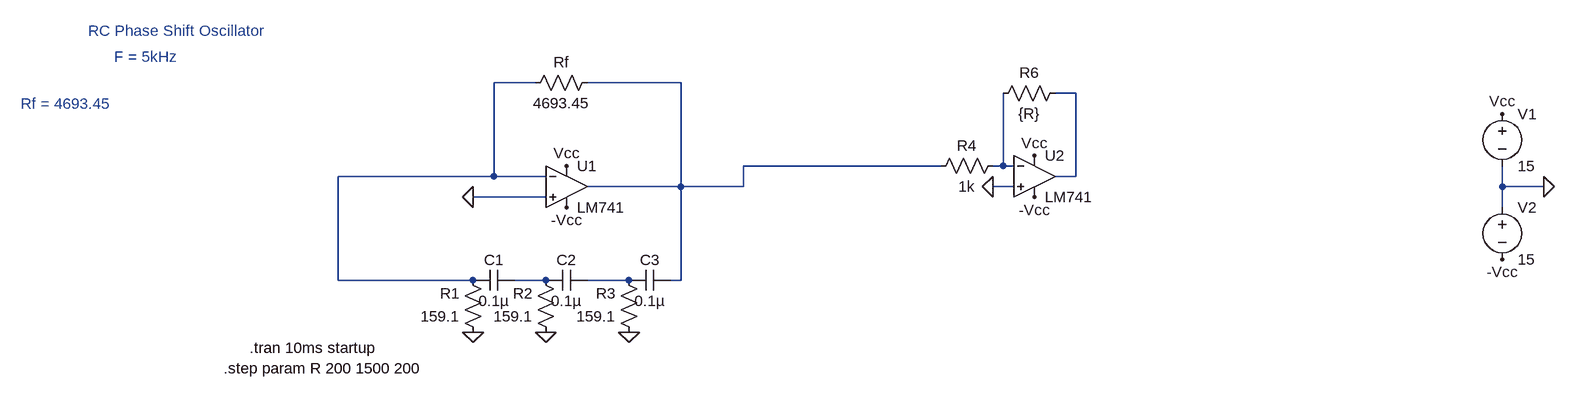
[diagram p0: schematic RC_PhaseShift_Oscillator.asc]
RC_PhaseShift_Oscillator.asc, the LTspice schematic file:
Version 4
SHEET 1 1748 680
WIRE 176 16 112 16
WIRE 400 16 256 16
WIRE 1008 32 976 32
WIRE 800 144 496 144
WIRE 896 144 896 32
WIRE 896 144 880 144
WIRE 912 144 896 144
WIRE 112 160 112 16
WIRE 112 160 -128 160
WIRE 192 160 112 160
WIRE 1008 160 1008 32
WIRE 1008 160 976 160
WIRE 400 176 400 16
WIRE 400 176 256 176
WIRE 496 176 496 144
WIRE 496 176 400 176
WIRE 912 176 880 176
WIRE 1664 176 1664 144
WIRE 1728 176 1664 176
WIRE 192 192 80 192
WIRE 1664 208 1664 176
WIRE -128 320 -128 160
WIRE 80 320 -128 320
WIRE 192 320 144 320
WIRE 320 320 256 320
WIRE 400 320 400 176
WIRE 400 320 384 320
FLAG 80 400 0
FLAG 192 400 0
FLAG 320 400 0
FLAG 1728 176 0
FLAG 80 192 0
FLAG 1664 64 Vcc
FLAG 224 144 Vcc
FLAG 1664 288 -Vcc
FLAG 224 208 -Vcc
FLAG 944 128 Vcc
FLAG 944 192 -Vcc
FLAG 880 176 0
SYMBOL res 272 0 R90
WINDOW 0 0 56 VBottom 2
WINDOW 3 32 56 VTop 2
SYMATTR InstName Rf
SYMATTR Value 4693.45
SYMBOL res 96 416 R180
WINDOW 0 36 76 Left 2
WINDOW 3 36 40 Left 2
SYMATTR InstName R1
SYMATTR Value 159.1
SYMBOL res 208 416 R180
WINDOW 0 36 76 Left 2
WINDOW 3 36 40 Left 2
SYMATTR InstName R2
SYMATTR Value 159.1
SYMBOL res 336 416 R180
WINDOW 0 36 76 Left 2
WINDOW 3 36 40 Left 2
SYMATTR InstName R3
SYMATTR Value 159.1
SYMBOL cap 144 304 R90
WINDOW 0 0 32 VBottom 2
WINDOW 3 32 32 VTop 2
SYMATTR InstName C1
SYMATTR Value 0.1µ
SYMBOL cap 256 304 R90
WINDOW 0 0 32 VBottom 2
WINDOW 3 32 32 VTop 2
SYMATTR InstName C2
SYMATTR Value 0.1µ
SYMBOL cap 384 304 R90
WINDOW 0 0 32 VBottom 2
WINDOW 3 32 32 VTop 2
SYMATTR InstName C3
SYMATTR Value 0.1µ
SYMBOL voltage 1664 48 R0
WINDOW 123 0 0 Left 0
WINDOW 39 0 0 Left 0
SYMATTR InstName V1
SYMATTR Value 15
SYMBOL voltage 1664 192 R0
WINDOW 123 0 0 Left 0
WINDOW 39 0 0 Left 0
SYMATTR InstName V2
SYMATTR Value 15
SYMBOL OpAmps\\LM741 224 112 R0
SYMATTR InstName U1
SYMBOL OpAmps\\LM741 944 96 R0
SYMATTR InstName U2
SYMBOL res 896 128 R90
WINDOW 0 0 56 VBottom 2
WINDOW 3 32 56 VTop 2
SYMATTR InstName R4
SYMATTR Value 1k
SYMBOL res 992 16 R90
WINDOW 0 0 56 VBottom 2
WINDOW 3 32 56 VTop 2
SYMATTR InstName R6
SYMATTR Value {R}
TEXT -264 424 Left 2 !.tran 10ms startup
TEXT -512 -64 Left 2 ;RC Phase Shift Oscillator
TEXT -472 -24 Left 2 ;F = 5kHz
TEXT -616 48 Left 2 ;Rf = 4693.45
TEXT -304 456 Left 2 !.step param R 200 1500 200

The netlist it stands for:
* RC_PhaseShift_Oscillator.asc
Rf N002 N001 4693.45
R1 0 N001 159.1
R2 0 N005 159.1
R3 0 N006 159.1
C1 N005 N001 0.1µ
C2 N006 N005 0.1µ
C3 N002 N006 0.1µ
V1 Vcc 0 15
V2 0 -Vcc 15
XU1 0 N001 Vcc -Vcc N002 LM741  ; pins In+ In- V+ V- OUT
XU2 0 N004 Vcc -Vcc N003 LM741  ; pins In+ In- V+ V- OUT
R4 N004 N002 1k
R6 N003 N004 {R}
.tran 10ms startup
* RC Phase Shift Oscillator
* F = 5kHz
* Rf = 4693.45
.step param R 200 1500 200
.lib LM741.lib
.backanno
.end